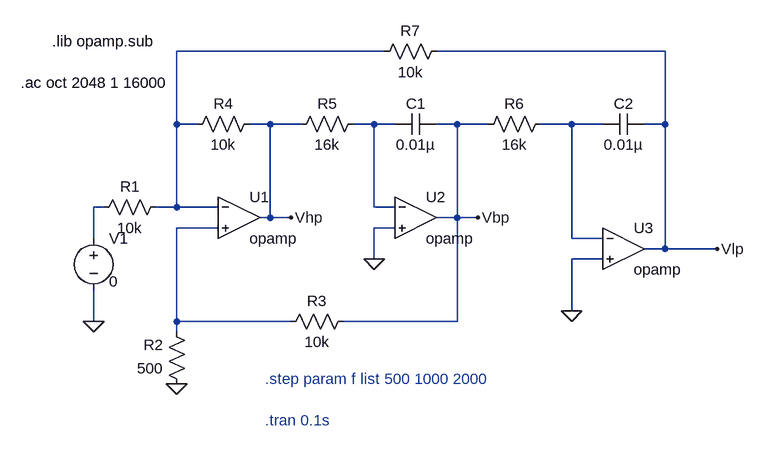
[diagram p0: schematic biquad.asc]
biquad.asc, the LTspice schematic file:
Version 4
SHEET 1 944 680
WIRE 384 32 64 32
WIRE 816 32 464 32
WIRE 64 144 64 32
WIRE 96 144 64 144
WIRE 208 144 176 144
WIRE 256 144 208 144
WIRE 368 144 336 144
WIRE 400 144 368 144
WIRE 496 144 464 144
WIRE 544 144 496 144
WIRE 672 144 624 144
WIRE 720 144 672 144
WIRE 816 144 816 32
WIRE 816 144 784 144
WIRE -48 272 -64 272
WIRE 64 272 64 144
WIRE 64 272 32 272
WIRE 128 272 64 272
WIRE 368 272 368 144
WIRE 400 272 368 272
WIRE 208 288 208 144
WIRE 208 288 192 288
WIRE 240 288 208 288
WIRE 496 288 496 144
WIRE 496 288 464 288
WIRE 528 288 496 288
WIRE 128 304 64 304
WIRE 400 304 368 304
WIRE -64 320 -64 272
WIRE 672 320 672 144
WIRE 720 320 672 320
WIRE 816 336 816 144
WIRE 816 336 784 336
WIRE 896 336 816 336
WIRE 368 352 368 304
WIRE 720 352 672 352
WIRE 672 432 672 352
WIRE -64 448 -64 400
WIRE 64 448 64 304
WIRE 240 448 64 448
WIRE 496 448 496 288
WIRE 496 448 320 448
WIRE 64 464 64 448
FLAG -64 448 0
FLAG 64 544 0
FLAG 368 352 0
FLAG 672 432 0
FLAG 240 288 Vhp
FLAG 528 288 Vbp
FLAG 896 336 Vlp
SYMBOL opamp 160 224 R0
SYMATTR InstName U1
SYMBOL opamp 432 224 R0
SYMATTR InstName U2
SYMBOL opamp 752 272 R0
SYMATTR InstName U3
SYMBOL res 48 256 R90
WINDOW 0 0 56 VBottom 2
WINDOW 3 32 56 VTop 2
SYMATTR InstName R1
SYMATTR Value 10k
SYMBOL res 80 560 R180
WINDOW 0 36 76 Left 2
WINDOW 3 36 40 Left 2
SYMATTR InstName R2
SYMATTR Value 500
SYMBOL res 224 464 R270
WINDOW 0 32 56 VTop 2
WINDOW 3 0 56 VBottom 2
SYMATTR InstName R3
SYMATTR Value 10k
SYMBOL res 80 160 R270
WINDOW 0 32 56 VTop 2
WINDOW 3 0 56 VBottom 2
SYMATTR InstName R4
SYMATTR Value 10k
SYMBOL res 240 160 R270
WINDOW 0 32 56 VTop 2
WINDOW 3 0 56 VBottom 2
SYMATTR InstName R5
SYMATTR Value 16k
SYMBOL res 528 160 R270
WINDOW 0 32 56 VTop 2
WINDOW 3 0 56 VBottom 2
SYMATTR InstName R6
SYMATTR Value 16k
SYMBOL res 368 48 R270
WINDOW 0 32 56 VTop 2
WINDOW 3 0 56 VBottom 2
SYMATTR InstName R7
SYMATTR Value 10k
SYMBOL cap 464 128 R90
WINDOW 0 0 32 VBottom 2
WINDOW 3 32 32 VTop 2
SYMATTR InstName C1
SYMATTR Value 0.01µ
SYMBOL cap 784 128 R90
WINDOW 0 0 32 VBottom 2
WINDOW 3 32 32 VTop 2
SYMATTR InstName C2
SYMATTR Value 0.01µ
SYMBOL voltage -64 304 R0
WINDOW 3 24 82 Left 2
SYMATTR Value 0
SYMATTR InstName V1
SYMATTR Value2 AC 1
TEXT -128 16 Left 2 !.lib opamp.sub
TEXT -176 80 Left 2 !.ac oct 2048 1 16000
TEXT 200 536 Left 2 ;.step param f list 500 1000 2000
TEXT 200 600 Left 2 ;.tran 0.1s

The netlist it stands for:
* biquad.asc
XU1 N001 N005 Vhp opamp Aol=100K GBW=10Meg  ; pins invin noninvin out
XU2 N002 0 Vbp opamp Aol=100K GBW=10Meg  ; pins invin noninvin out
XU3 N003 0 Vlp opamp Aol=100K GBW=10Meg  ; pins invin noninvin out
R1 N001 N004 10k
R2 0 N005 500
R3 N005 Vbp 10k
R4 N001 Vhp 10k
R5 Vhp N002 16k
R6 Vbp N003 16k
R7 N001 Vlp 10k
C1 Vbp N002 0.01µ
C2 Vlp N003 0.01µ
V1 N004 0 0 AC 1
.lib opamp.sub
.ac oct 2048 1 16000
* .step param f list 500 1000 2000
* .tran 0.1s
.backanno
.end